# Altium schematic sheet FAN_IF.SchDoc
size A4; SheetNumber: 21; SheetTotal: 25
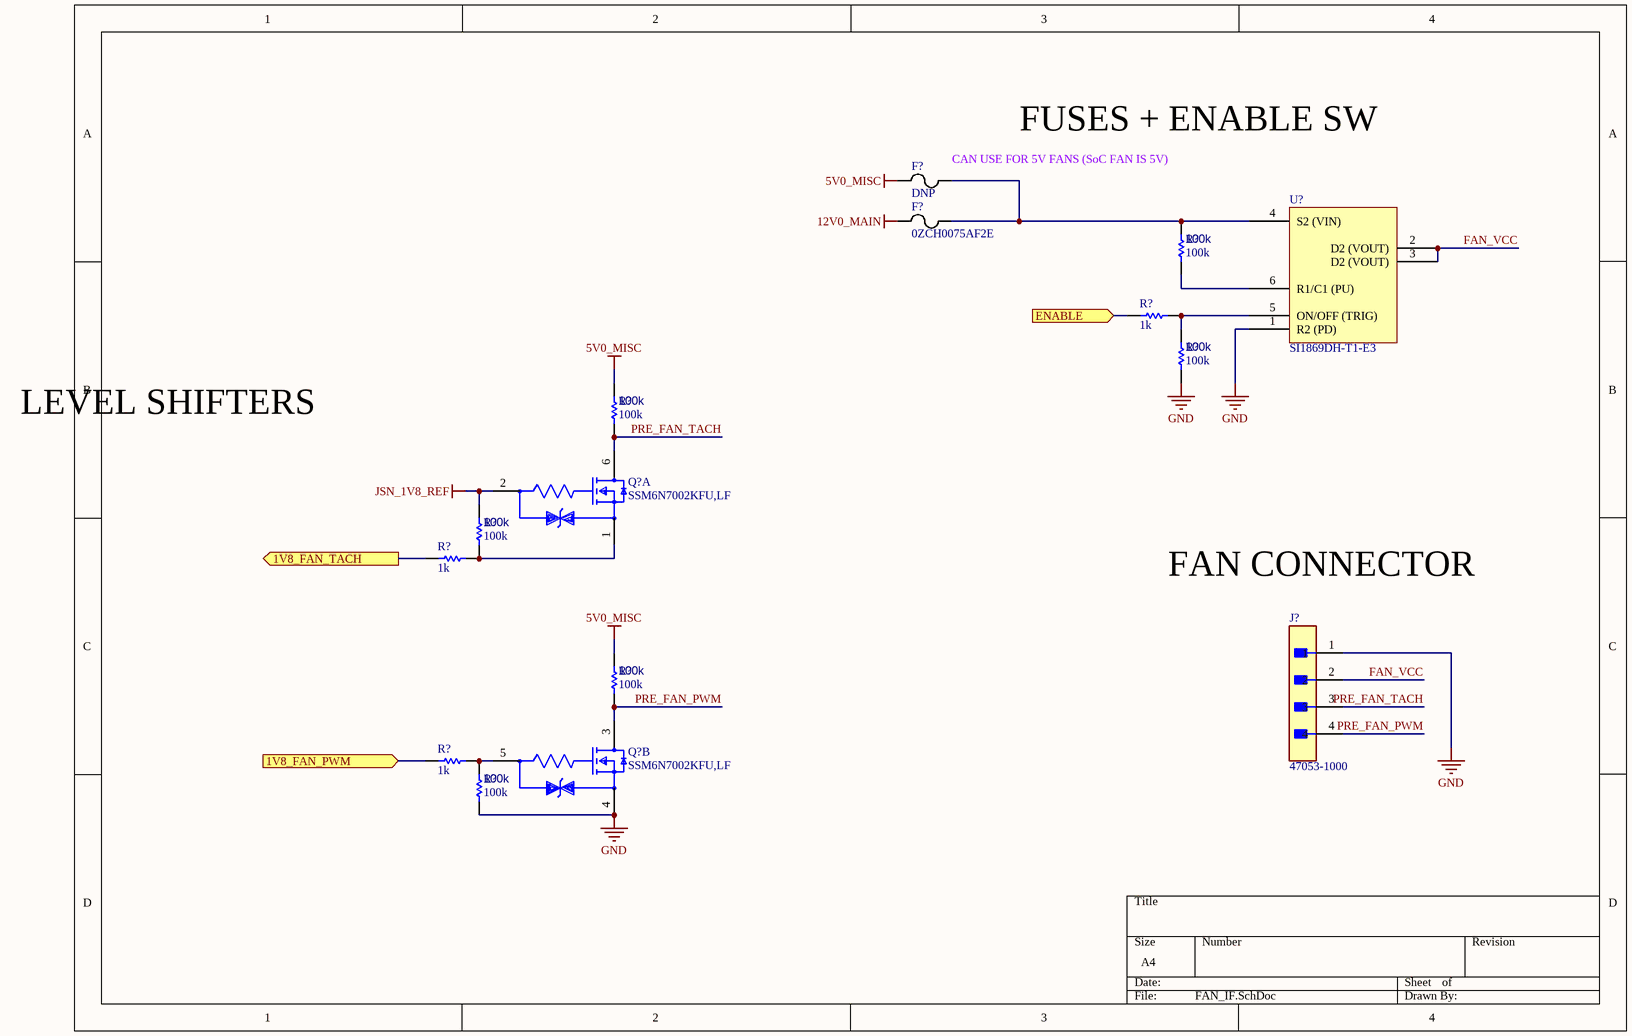
[diagram p0: FAN_IF.SchDoc]

## Parts
(Parts that share a designator on the sheet are numbered #1, #2 ... from top to bottom, then left to right.)
F?#1  DNP  [0ZCH0075AF2E-Footprint-1]
F?#2  0ZCH0075AF2E  [0ZCH0075AF2E-Footprint-1]
J?  47053-1000  [FP-470531000-MFG]
Q?#1  SSM6N7002KFU,LF  [FP-SSOP6-P-0_65A-MFG]  (part A of 2)
Q?#2  SSM6N7002KFU,LF  [FP-SSOP6-P-0_65A-MFG]  (part B of 2)
R?#1  100k  [R0603B]
R?#2  1k  [R0603B]
R?#3  100k  [R0603B]
R?#4  100k  [R0603B]
R?#5  100k  [R0603B]
R?#6  1k  [R0603B]
R?#7  100k  [R0603B]
R?#8  1k  [R0603B]
R?#9  100k  [R0603B]
U?  SI1869DH-T1-E3  [SOT65P242X110-6N]

## Ports
1V8_FAN_PWM (in), 1V8_FAN_TACH (out), ENABLE (in, see ADAS_ECU_revA[1C])

## Nets
5V0_MISC: F?#1.1 R?#4.2 R?#7.2
12V0_MAIN: F?#2.1
GND: J?.1 Q?#2.4(Source2) R?#3.1 R?#9.1 U?.1(R2_(PD))
JSN_1V8_REF: Q?#1.2(Gate1) R?#5.2
1V8_FAN_PWM: R?#8.2 ; port 1V8_FAN_PWM
1V8_FAN_TACH: R?#6.2 ; port 1V8_FAN_TACH
ENABLE: R?#2.2 ; port ENABLE
FAN_VCC: J?.2 U?.2(D2_(VOUT)) U?.3(D2_(VOUT))
PRE_FAN_PWM: J?.4 Q?#2.3(Drain2) R?#7.1
PRE_FAN_TACH: J?.3 Q?#1.6(Drain1) R?#4.1
NetF?#1_2: F?#1.2 F?#2.2 R?#1.2 U?.4(S2_(VIN))
NetQ?#1_1: Q?#1.1(Source1) R?#5.1 R?#6.1
NetQ?#2_5: Q?#2.5(Gate2) R?#8.1 R?#9.2
NetR?#1_1: R?#1.1 U?.6(R1/C1_(PU))
NetR?#2_1: R?#2.1 R?#3.2 U?.5(ON/OFF_(TRIG))

## Notes on the sheet
- (near F?#1) CAN USE FOR 5V FANS (SoC FAN IS 5V)
- FUSES + ENABLE SW
- LEVEL SHIFTERS
- FAN CONNECTOR

## Library data of the parts
F?#1 F?#2 = CMP-005-00028-2: PTC Thermistor; RoHS Compliant: Yes
J? = CMP-04776-000290-2: CONN HEADER VERT 4POS 2.54MM; NexarPartId: 854935; Manufacturer Lifecycle Status: ACTIVE; Voltage Rating (DC): 250V; Gender: Male; Plating: Copper; Number of Positions: 4; Glow Wire Compliant: Non-compliant; Current Rating: 500mA; Max Operating Temperature: 75°C; Number of Rows: 1; REACH SVHC: Unknown; Ambient Temperature Range High: 105°C; Pitch: 2.54mm; Height: 7.7mm; Min Operating Temperature: 0°C; Packaging: Bulk; Contact Material: Brass, Copper; Contact Plating: Tin; Lead Pitch: 2.54mm; Voltage Rating: 250V; Termination: Through Hole; Radiation Hardening: No; Orientation: Vertical; Mount: Through Hole; Number of Pins: 4; Country of Origin: HK; Halogen Free: Low Halogen; Lifecycle Status: Production; Number of Circuits: 4; Schedule B: 8536694040, 8536694040; Housing Color: Beige; Housing Material: Nylon; Depth: 5.84mm; RoHS: Compliant; Length: 10.2mm; Number of Contacts: 4
Q?#1 Q?#2 = CMP-35916-000009-1: MOSFET 2N-CH 60V 0.3A; Input Capacitance: 40pF; Continuous Drain Current (ID): 300mA; Max Power Dissipation: 285mW; FET Type: 2 N-Channel; Rds On Max: 1.5R; Mount: Surface Mount; Drain to Source Voltage (Vdss): 60V; Packaging: Tape and Reel
R?#1-R?#9 = CMP-009-00002-14: Resistor
  R?#1 R?#3-R?#5 R?#7 R?#9: Value: 100k
U? = CMP-019-00043-2: Power Supply Support Circuit, Adjustable, 1 Channel, PDSO6; Max Supply Voltage: 20V; Min Supply Voltage: 1.8V; Case/Package: TSSOP; Pins: 6; RoHS Compliant: Yes